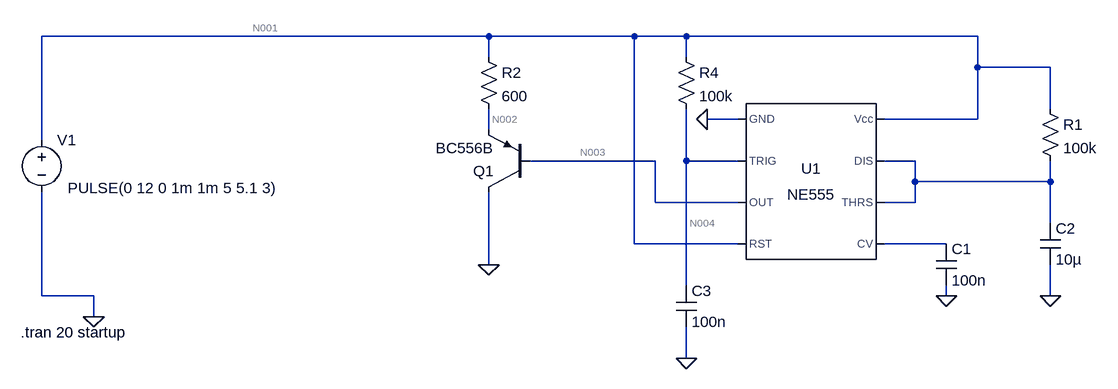
[diagram p0: schematic 555.asc]
555.asc, the LTspice schematic file:
Version 4
SHEET 1 1656 680
WIRE 480 0 -208 0
WIRE 704 0 480 0
WIRE 784 0 704 0
WIRE 1232 0 784 0
WIRE 480 32 480 0
WIRE 784 32 784 0
WIRE 1232 48 1232 0
WIRE 1344 48 1232 48
WIRE 1344 112 1344 48
WIRE 864 128 816 128
WIRE 1232 128 1232 48
WIRE 1232 128 1088 128
WIRE 480 144 480 112
WIRE -208 160 -208 0
WIRE 736 192 544 192
WIRE 784 192 784 112
WIRE 864 192 784 192
WIRE 1136 192 1088 192
WIRE 1136 224 1136 192
WIRE 1344 224 1344 192
WIRE 1344 224 1136 224
WIRE 736 256 736 192
WIRE 864 256 736 256
WIRE 1136 256 1136 224
WIRE 1136 256 1088 256
WIRE 1344 288 1344 224
WIRE 704 320 704 0
WIRE 864 320 704 320
WIRE 1184 320 1088 320
WIRE 480 352 480 240
WIRE 784 384 784 192
WIRE -208 400 -208 240
WIRE -128 400 -208 400
WIRE 1184 400 1184 384
WIRE 1344 400 1344 352
WIRE -128 432 -128 400
WIRE 784 496 784 448
FLAG -128 432 0
FLAG 816 128 0
FLAG 1184 400 0
FLAG 1344 400 0
FLAG 784 496 0
FLAG 480 352 0
SYMBOL voltage -208 144 R0
WINDOW 3 40 90 Left 2
WINDOW 123 0 0 Left 0
WINDOW 39 0 0 Left 0
SYMATTR Value PULSE(0 12 0 1m 1m 5 5.1 3)
SYMATTR InstName V1
SYMBOL Misc\\NE555 976 224 R0
SYMATTR InstName U1
SYMBOL cap 1168 320 R0
SYMATTR InstName C1
SYMATTR Value 100n
SYMBOL cap 1328 288 R0
SYMATTR InstName C2
SYMATTR Value 10µ
SYMBOL res 1328 96 R0
SYMATTR InstName R1
SYMATTR Value 100k
SYMBOL cap 768 384 R0
SYMATTR InstName C3
SYMATTR Value 100n
SYMBOL res 768 16 R0
SYMATTR InstName R4
SYMATTR Value 100k
SYMBOL res 464 16 R0
SYMATTR InstName R2
SYMATTR Value 600
SYMBOL pnp 544 240 R180
SYMATTR InstName Q1
SYMATTR Value BC556B
TEXT -240 456 Left 2 !.tran 20 startup

The netlist it stands for:
* 555.asc
V1 N001 0 PULSE(0 12 0 1m 1m 5 5.1 3)
XU1 0 N004 N003 N001 N006 N005 N005 N001 NE555  ; pins GND TRIG OUT RST CV THRS DIS Vcc
C1 N006 0 100n
C2 N005 0 10µ
R1 N001 N005 100k
C3 N004 0 100n
R4 N001 N004 100k
R2 N001 N002 600
Q1 0 N003 N002 0 BC556B
.model NPN NPN
.model PNP PNP
.lib standard.bjt
.tran 20 startup
.lib NE555.sub
.backanno
.end

* Results of the author's LTspice run, read from the files saved beside the schematic
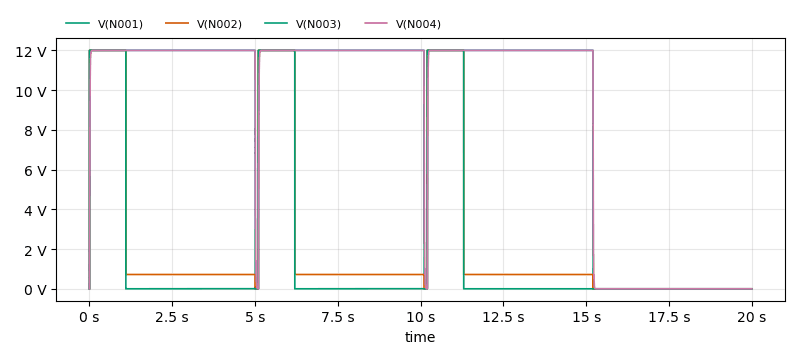
[diagram p1: Transient Analysis of 555.asc, plotted from the saved traces]
* Transient Analysis, 1 run:
*   V(N001): min 0 V, max 12 V, average 9.002 V, rms 10.39 V, last 0 V
*   V(N002): min -2.255 µV, max 12 V, average 2.4 V, rms 4.903 V, last 0 V
*   V(N003): min -1.274 µV, max 12 V, average 1.979 V, rms 4.872 V, last 0 V
*   V(N004): min -3.41 µV, max 12 V, average 9.001 V, rms 10.38 V, last 0 V